# Altium project Driver_Display.PrjPcb (part 2 of 2)
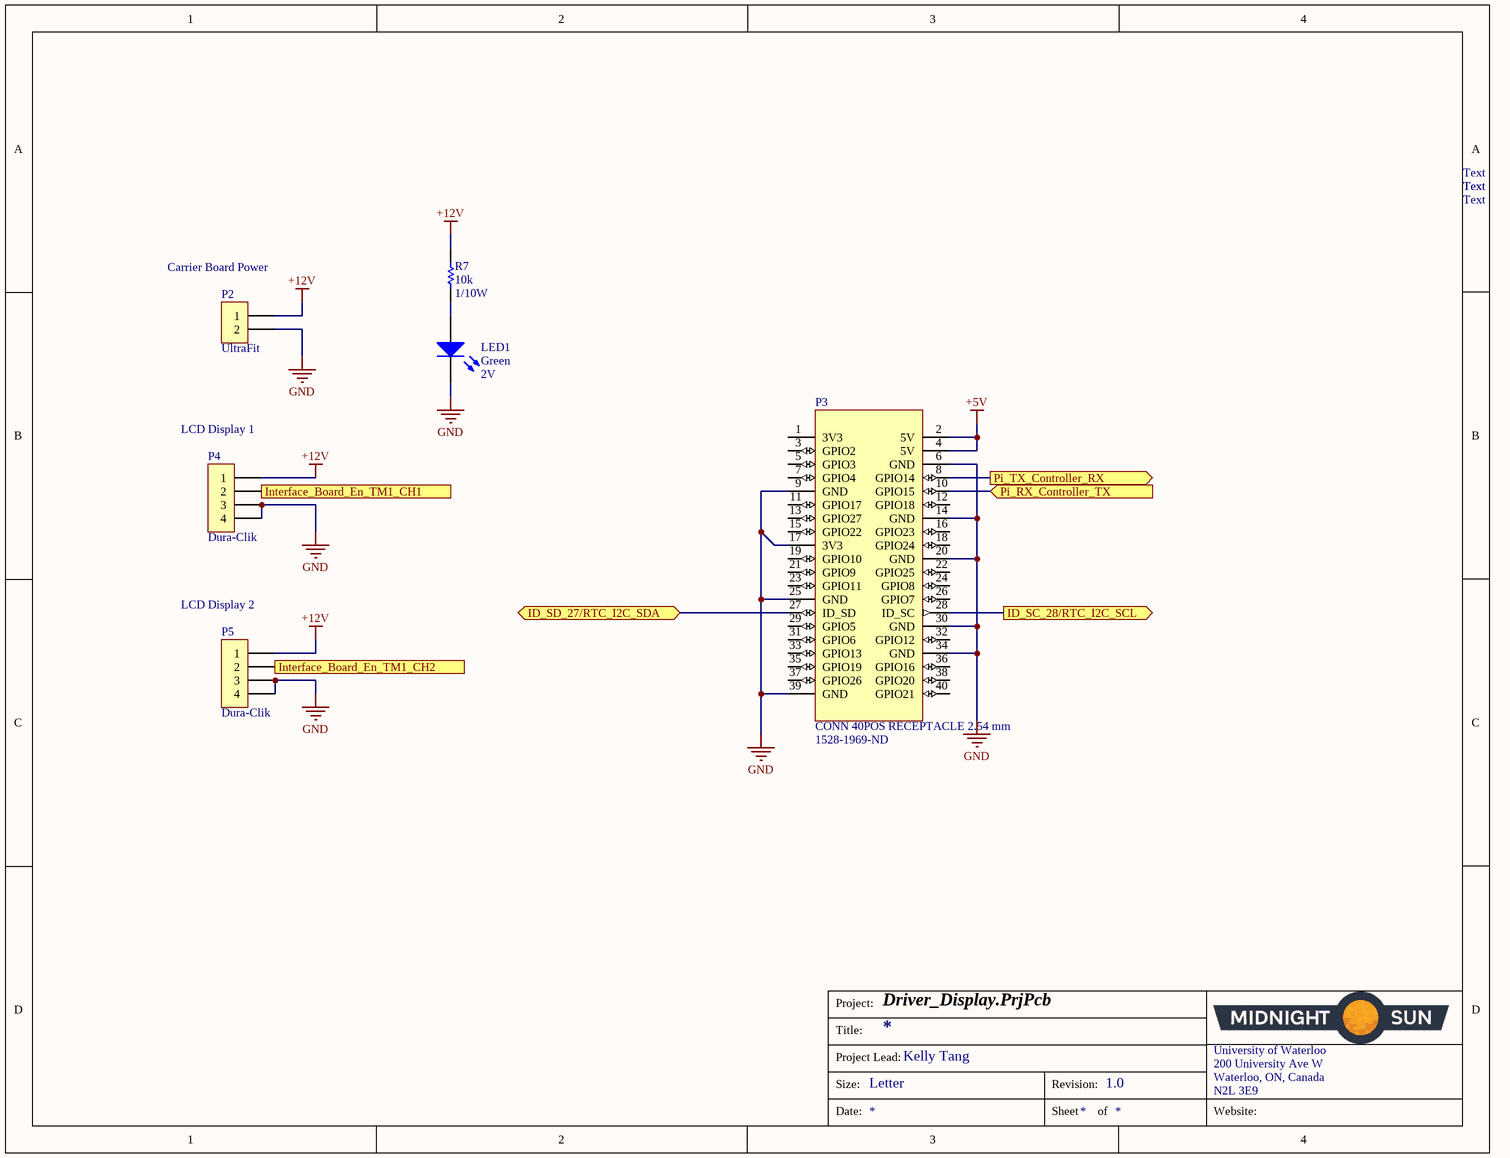
[diagram p5: Connectors.SchDoc]

## Nets that join several sheets
3V0: Voltage Regulator (C12.1 U4.1 U5.5), RTC (R4.1), Ambient Light Sensor (C13.1 U1.5)
3V3: Controller_Board_Interface (6 pins), Voltage Regulator (C11.1 U4.3 U4.4)
+5V: Voltage Regulator (6 pins), Connectors (P3.2 P3.4)
+12V: Controller_Board_Interface (P6.47 P6.48 P6.49 P6.50), Voltage Regulator (C10.1 R5.2 U3.3), Connectors (P2.1 P4.1 P5.1 R7.2)
GND: Controller_Board_Interface (8 pins), Voltage Regulator (11 pins), RTC (5 pins), Ambient Light Sensor (8 pins), Connectors (15 pins)
NetP3_27: RTC (U2.5), Connectors (P3.27)
NetP3_28: RTC (U2.6), Connectors (P3.28)
PA0/AN0: Controller_Board_Interface (P6.25), Ambient Light Sensor (C1.1 R1.2)
PA1/AN1: Controller_Board_Interface (P6.24), Voltage Regulator (U5.1 U5.4)
PA8: Controller_Board_Interface (P6.7), Connectors (P4.2)
PA9: Controller_Board_Interface (P6.6), Connectors (P5.2)
PB10/USART3_TX/I2C2_SCL: Controller_Board_Interface (P6.14), Connectors (P3.10)
PB11/USART3_RX/I2C2_SDA: Controller_Board_Interface (P6.13), Connectors (P3.8)